# EAGLE design DES1 v70 (EAGLE 9.7.0)
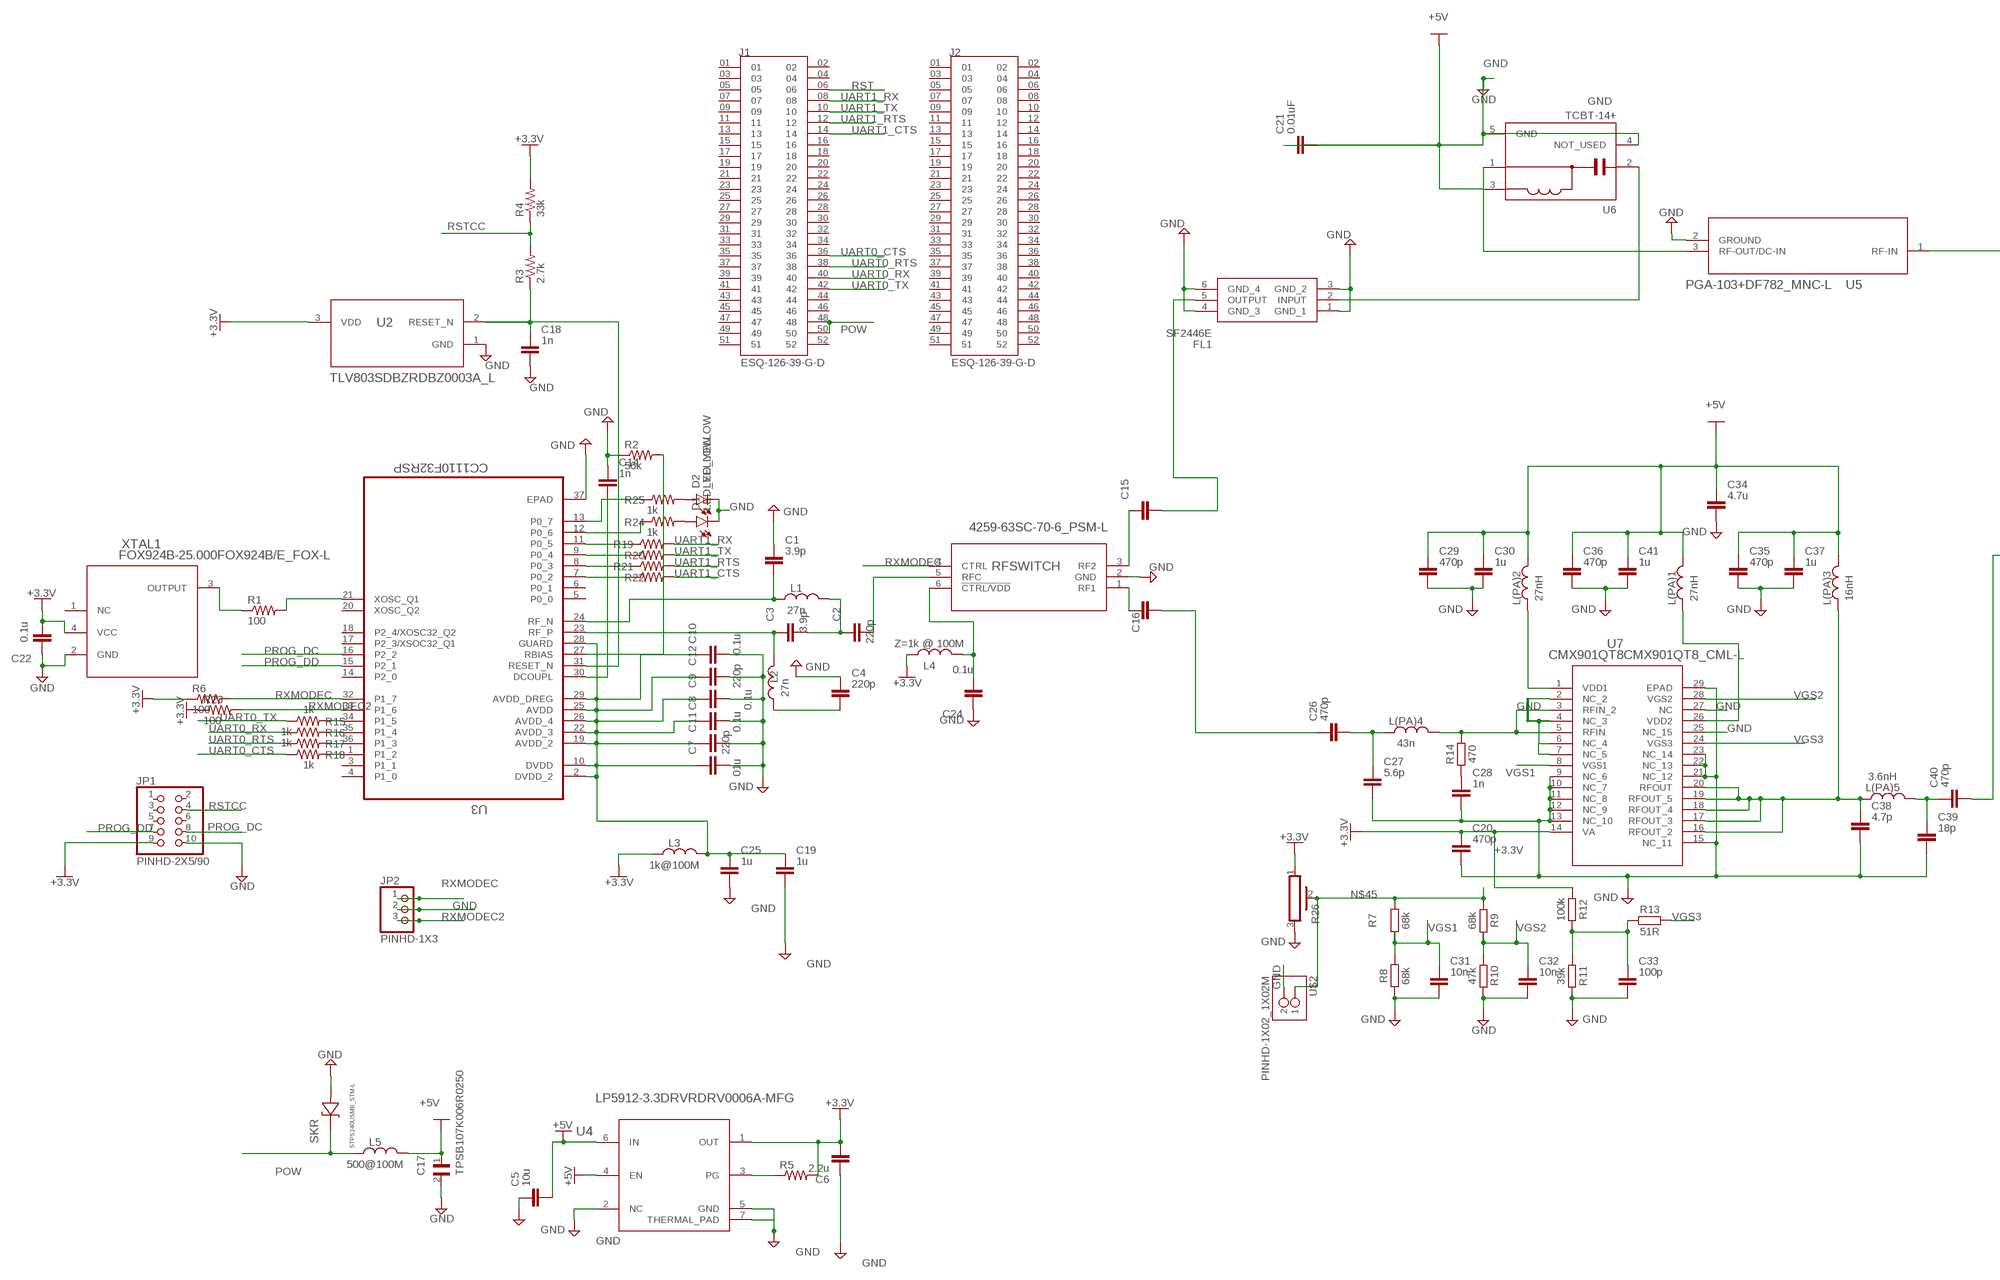
[diagram p0: schematic, sheet 1, part 1 of 2]
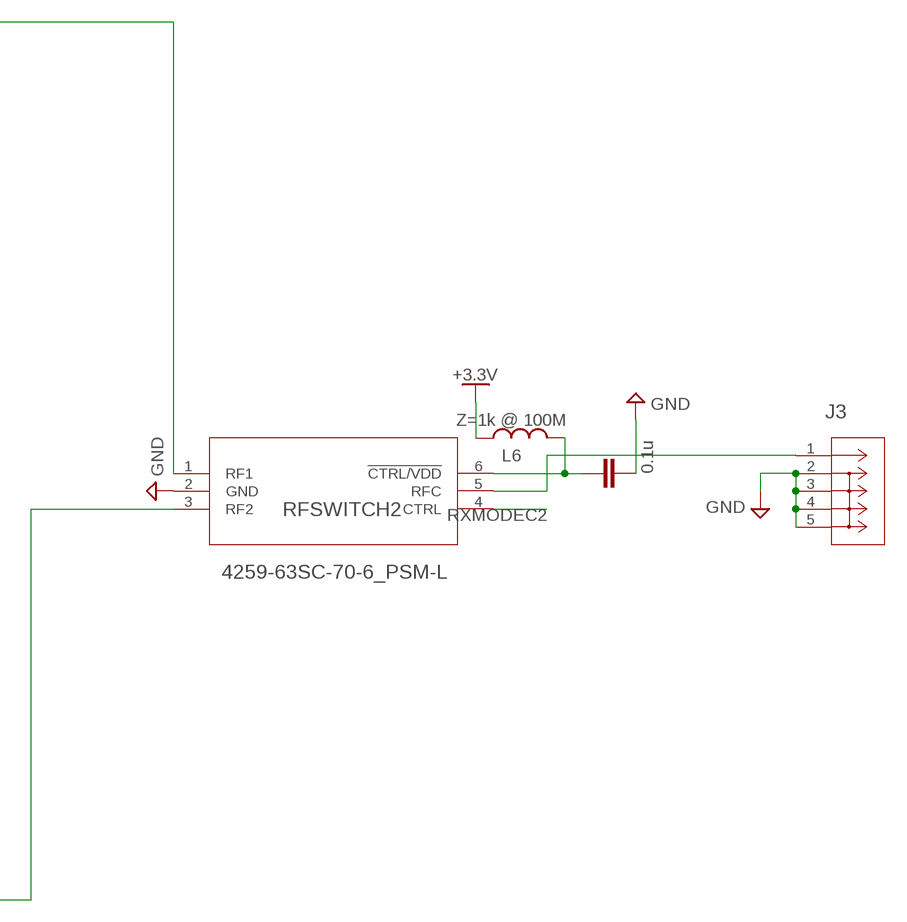
[diagram p1: schematic, sheet 1, part 2 of 2]

## Parts
C1  3.9p  C_CHIP-0402(1005-METRIC)  [CAPC1005X60]
C2  220p  C_CHIP-0402(1005-METRIC)  [CAPC1005X60]
C3  3.9p  C_CHIP-0402(1005-METRIC)  [CAPC1005X60]
C4  220p  C_CHIP-0402(1005-METRIC)  [CAPC1005X60]
C5  10u  C_CHIP-0603(1608-METRIC)  [CAPC1608X85]
C6  2.2u  C_CHIP-0603(1608-METRIC)  [CAPC1608X85]
C7  01u  C_CHIP-0603(1608-METRIC)  [CAPC1608X85]
C8  0.1u  C_CHIP-0603(1608-METRIC)  [CAPC1608X85]
C9  0.1u  C_CHIP-0603(1608-METRIC)  [CAPC1608X85]
C10  0.1u  C_CHIP-0603(1608-METRIC)  [CAPC1608X85]
C11  220p  C_CHIP-0402(1005-METRIC)  [CAPC1005X60]
C12  220p  C_CHIP-0402(1005-METRIC)  [CAPC1005X60]
C13  0.1u  C_CHIP-0603(1608-METRIC)  [CAPC1608X85]
C14  1n  C_CHIP-0603(1608-METRIC)  [CAPC1608X85]
C15  C_CHIP-0402(1005-METRIC)  [CAPC1005X60]
C16  C_CHIP-0402(1005-METRIC)  [CAPC1005X60]
C17  TPSB107K006R0250  [CAPPC3528X210N]
C18  1n  C_CHIP-0603(1608-METRIC)  [CAPC1608X85]
C19  1u  C_CHIP-0603(1608-METRIC)  [CAPC1608X85]
C20  470p  C_CHIP-0603(1608-METRIC)  [CAPC1608X85]
C21  0.01uF  C_CHIP-0805(2012-METRIC)  [CAPC2012X110]
C22  0.1u  C_CHIP-0603(1608-METRIC)  [CAPC1608X85]
C24  0.1u  C_CHIP-0603(1608-METRIC)  [CAPC1608X85]
C25  1u  C_CHIP-0603(1608-METRIC)  [CAPC1608X85]
C26  470p  C_CHIP-0603(1608-METRIC)  [CAPC1608X85]
C27  5.6p  C_CHIP-0603(1608-METRIC)  [CAPC1608X85]
C28  1n  C_CHIP-0603(1608-METRIC)  [CAPC1608X85]
C29  470p  C_CHIP-0603(1608-METRIC)  [CAPC1608X85]
C30  1u  C_CHIP-0603(1608-METRIC)  [CAPC1608X85]
C31  10n  C_CHIP-0603(1608-METRIC)  [CAPC1608X85]
C32  10n  C_CHIP-0603(1608-METRIC)  [CAPC1608X85]
C33  100p  C_CHIP-0603(1608-METRIC)  [CAPC1608X85]
C34  4.7u  C_CHIP-0603(1608-METRIC)  [CAPC1608X85]
C35  470p  C_CHIP-0603(1608-METRIC)  [CAPC1608X85]
C36  470p  C_CHIP-0603(1608-METRIC)  [CAPC1608X85]
C37  1u  C_CHIP-0603(1608-METRIC)  [CAPC1608X85]
C38  4.7p  C_CHIP-0603(1608-METRIC)  [CAPC1608X85]
C39  18p  C_CHIP-0603(1608-METRIC)  [CAPC1608X85]
C40  470p  C_CHIP-0603(1608-METRIC)  [CAPC1608X85]
C41  1u  C_CHIP-0603(1608-METRIC)  [CAPC1608X85]
D1  LED_YELLOW  CHIP-FLAT-Y_0402  [LEDC1005X25N_FLAT-Y]
D2  LED_YELLOW  CHIP-FLAT-Y_0402  [LEDC1005X25N_FLAT-Y]
FL1  SF2446E  [SF2446E]
J1  ESQ-126-39-G-D  [SAMTEC_ESQ-126-39-G-D]
J2  ESQ-126-39-G-D  [SAMTEC_ESQ-126-39-G-D]
J3  733910070CONN_73391-0070_MOL  [CONN_73391-0070_MOL]
JP1  PINHD-2X5/90  [2X05/90]
JP2  PINHD-1X3  [1X03]
L1  27n  INDUCTOR_CHIP-0402(1006-METRIC)  [INDC1006X60N]
L2  27n  INDUCTOR_CHIP-0402(1006-METRIC)  [INDC1006X60N]
L3  1k@100M  INDUCTOR_CHIP-0603(1608-METRIC)  [INDC1608X95N]
L4  Z=1k @ 100M  INDUCTOR_CHIP-0603(1608-METRIC)  [INDC1608X95N]
L5  500@100M  INDUCTOR_CHIP-1206(3216-METRIC)  [INDC3216X190]
L6  Z=1k @ 100M  INDUCTOR_CHIP-0603(1608-METRIC)  [INDC1608X95N]
L(PA)1  27nH  L_CHIP-0603(1608-METRIC)  [INDC1608X95N]
L(PA)2  27nH  L_CHIP-0603(1608-METRIC)  [INDC1608X95N]
L(PA)3  16nH  L_CHIP-0603(1608-METRIC)  [INDC1608X95N]
L(PA)4  43n  L_CHIP-0603(1608-METRIC)  [INDC1608X95N]
L(PA)5  3.6nH  INDUCTOR_CHIP-0603(1608-METRIC)  [INDC1608X95N]
R1  100  R-US_CHIP-0603(1608-METRIC)  [RESC1608X60]
R2  56k  R-US_CHIP-0603(1608-METRIC)  [RESC1608X60]
R3  2.7k  R-US_CHIP-0603(1608-METRIC)  [RESC1608X60]
R4  33k  R-US_CHIP-0603(1608-METRIC)  [RESC1608X60]
R5  R-US_CHIP-0603(1608-METRIC)  [RESC1608X60]
R6  100  R-US_CHIP-0603(1608-METRIC)  [RESC1608X60]
R7  68k  R_CHIP-0603(1608-METRIC)  [RESC1608X60]
R8  68k  R_CHIP-0603(1608-METRIC)  [RESC1608X60]
R9  68k  R_CHIP-0603(1608-METRIC)  [RESC1608X60]
R10  47k  R_CHIP-0603(1608-METRIC)  [RESC1608X60]
R11  39k  R_CHIP-0603(1608-METRIC)  [RESC1608X60]
R12  100k  R_CHIP-0603(1608-METRIC)  [RESC1608X60]
R13  51R  R_CHIP-0603(1608-METRIC)  [RESC1608X60]
R14  470  R_CHIP-0603(1608-METRIC)  [RESC1608X60]
R15  1k  R-US_CHIP-0603(1608-METRIC)  [RESC1608X60]
R16  1k  R-US_CHIP-0603(1608-METRIC)  [RESC1608X60]
R17  1k  R-US_CHIP-0603(1608-METRIC)  [RESC1608X60]
R18  1k  R-US_CHIP-0603(1608-METRIC)  [RESC1608X60]
R19  R-US_CHIP-0603(1608-METRIC)  [RESC1608X60]
R20  R-US_CHIP-0603(1608-METRIC)  [RESC1608X60]
R21  R-US_CHIP-0603(1608-METRIC)  [RESC1608X60]
R22  R-US_CHIP-0603(1608-METRIC)  [RESC1608X60]
R23  100  R-US_CHIP-0603(1608-METRIC)  [RESC1608X60]
R24  1k  R-US_CHIP-0603(1608-METRIC)  [RESC1608X60]
R25  1k  R-US_CHIP-0603(1608-METRIC)  [RESC1608X60]
R26  POT_PV36P  [PV36P]
RFSWITCH  4259-63SC-70-6_PSM-L  [SC-70-6_PSM-L]
RFSWITCH2  4259-63SC-70-6_PSM-L  [SC-70-6_PSM-L]
SKR  STPS340USMB_STM-L  [SMB_STM-L]
U2  TLV803SDBZRDBZ0003A_L  [DBZ0003A_L]
U3  CC1110F32RSP  [QFN50P600X600X90-37N]
U4  LP5912-3.3DRVRDRV0006A-MFG  [DRV0006A-MFG]
U5  PGA-103+DF782_MNC-L  [DF782_MNC-L]
U6  TCBT-14+  [IC_TCBT-14+]
U7  CMX901QT8CMX901QT8_CML-L  [CMX901QT8_CML-L]
U$2  PINHD-1X02_1X02M  [1X02]
XTAL1  FOX924B-25.000FOX924B/E_FOX-L  [FOX924B/E_FOX-L]

## Nets
+3.3V [POWER]: C6.2 C20.1 C22.2 JP1.9 L3.1 L4.1 L6.1 R4.2 R5.2 R6.1 R12.1 R23.1 R26.1 U2.3(VDD) U4.1(OUT) U7.14(VA) XTAL1.4(VCC)
+5V [POWER]: C5.2 C17.1 C21.1 C29.1 C30.1 C34.1 C35.1 C36.1 C37.1 C41.1 L5.2 L(PA)1.2 L(PA)2.2 L(PA)3.2 U4.4(EN) U4.6(IN) U6.3(DC)
GND [GND]: C1.1 C4.1 C5.1 C6.1 C7.2 C8.2 C9.2 C10.2 C11.2 C12.2 C13.2 C14.1 C17.2 C18.2 C19.2 C20.2 C21.2 C22.1 C24.1 C25.2 C27.2 C28.2 C29.2 C30.2 C31.2 C32.2 C33.2 C34.2 C35.2 C36.2 C37.2 C38.2 C39.2 C41.2 D1.C D2.C FL1.1(GND_1) FL1.3(GND_2) FL1.4(GND_3) FL1.6(GND_4) J3.2 J3.3 J3.4 J3.5 JP1.10 JP2.2 R2.1 R8.1 R10.2 R11.2 R26.3 RFSWITCH2.2(GND) RFSWITCH.2(GND) SKR.1(K) U2.1(GND) U3.37(EPAD) U4.2(NC) U4.5(GND) U4.7(THERMAL_PAD) U5.2(GROUND) U6.4(NOT_USED) U6.5(GND) U7.2(NC_2) U7.4(NC_3) U7.6(NC_4) U7.7(NC_5) U7.9(NC_6) U7.10(NC_7) U7.11(NC_8) U7.12(NC_9) U7.13(NC_10) U7.15(NC_11) U7.21(NC_12) U7.22(NC_13) U7.23(NC_14) U7.25(NC_15) U7.27(NC) U7.29(EPAD) U$2.2 XTAL1.2(GND)
N$1 [RF]: C15.1 RFSWITCH.3(RF2)
N$2 [RF]: C3.1 L2.2 U3.23(RF_P)
N$3 [RF]: C2.1 C3.2 L1.2
N$4 [RF]: C2.2 RFSWITCH.5(RFC)
N$5 [RF]: C4.2 L2.1
N$6 [RF]: C1.2 L1.1 U3.24(RF_N)
N$7: R22.1 U3.7(P0_2)
N$8: D1.A R24.2
N$9: R21.1 U3.8(P0_3)
N$10: R20.1 U3.9(P0_4)
N$11: R19.1 U3.11(P0_5)
N$12: R15.2 U3.34(P1_5)
N$13: R16.2 U3.35(P1_4)
N$14: R17.2 U3.36(P1_3)
N$15: R18.2 U3.1(P1_2)
N$16: R1.2 U3.21(XOSC_Q1)
N$17: R1.1 XTAL1.3(OUTPUT)
N$18: C24.2 L4.2 RFSWITCH.6(!CTRL/VDD)
N$19 [RF]: C16.2 C26.1
N$20 [RF]: RFSWITCH2.1(RF1) U5.1(RF-IN)
N$21 [RF]: C15.2 FL1.5(OUTPUT)
N$22 [RF]: U5.3(RF-OUT/DC-IN) U6.1(RF_DC)
N$23: C14.2 U3.30(DCOUPL)
N$27: D2.A R25.2
N$28 [RF]: C16.1 RFSWITCH.1(RF1)
N$30: FL1.2(INPUT) U6.2(RF)
N$31: R5.1 U4.3(PG)
N$32: R24.1 U3.12(P0_6)
N$33 [RF]: J3.1 RFSWITCH2.5(RFC)
N$34 [RF]: C39.1 C40.1 L(PA)5.2
N$35 [RF]: L(PA)4.2 R14.2 U7.3(RFIN_2) U7.5(RFIN)
N$37 [RF]: C26.2 C27.1 L(PA)4.1
N$38: L(PA)2.1 U7.1(VDD1)
N$39: L(PA)1.1 U7.26(VDD2)
N$40 [RF]: C38.1 L(PA)3.1 L(PA)5.1 U7.16(RFOUT_2) U7.17(RFOUT_3) U7.18(RFOUT_4) U7.19(RFOUT_5) U7.20(RFOUT)
N$41: C33.1 R11.1 R12.2 R13.1
N$42: C13.1 L6.2 RFSWITCH2.6(!CTRL/VDD)
N$43: C28.1 R14.1
N$44: R25.1 U3.13(P0_7)
N$45 [POWER]: R7.2 R9.1 R26.2 U$2.1
N$55 [RF]: C40.2 RFSWITCH2.3(RF2)
N$57: C7.1 C8.1 C9.1 C10.1 C11.1 C12.1 C19.1 C25.1 L3.2 U3.2(DVDD_2) U3.10(DVDD) U3.19(AVDD_2) U3.22(AVDD_3) U3.25(AVDD) U3.26(AVDD_4) U3.28(GUARD) U3.29(AVDD_DREG)
N$62: R2.2 U3.27(RBIAS)
POW: J1.48 J1.50 L5.1 SKR.2(A)
PROG_DC: JP1.8 U3.16(P2_2)
PROG_DD: JP1.7 U3.15(P2_1)
RST: C18.1 J1.06 R3.1 U2.2(RESET_N) U3.31(RESET_N)
RSTCC: JP1.4 R3.2 R4.1
RXMODEC: JP2.1 R6.2 RFSWITCH.4(CTRL) U3.32(P1_7)
RXMODEC2: JP2.3 R23.2 RFSWITCH2.4(CTRL) U3.33(P1_6)
UART0_CTS [UART]: J1.36 R18.1
UART0_RTS [UART]: J1.38 R17.1
UART0_RX [UART]: J1.40 R16.1
UART0_TX [UART]: J1.42 R15.1
UART1_CTS [UART]: J1.14 R22.2
UART1_RTS [UART]: J1.12 R21.2
UART1_RX [UART]: J1.08 R19.2
UART1_TX [UART]: J1.10 R20.2
VGS1: C31.1 R7.1 R8.2 U7.8(VGS1)
VGS2: C32.1 R9.2 R10.1 U7.28(VGS2)
VGS3: R13.2 U7.24(VGS3)
Unconnected: J1.01 J1.02 J1.03 J1.04 J1.05 J1.07 J1.09 J1.11 J1.13 J1.15 J1.16 J1.17 J1.18 J1.19 J1.20 J1.21 J1.22 J1.23 J1.24 J1.25 J1.26 J1.27 J1.28 J1.29 J1.30 J1.31 J1.32 J1.33 J1.34 J1.35 J1.37 J1.39 J1.41 J1.43 J1.44 J1.45 J1.46 J1.47 J1.49 J1.51 J1.52 J2.01 J2.02 J2.03 J2.04 J2.05 J2.06 J2.07 J2.08 J2.09 J2.10 J2.11 J2.12 J2.13 J2.14 J2.15 J2.16 J2.17 J2.18 J2.19 J2.20 J2.21 J2.22 J2.23 J2.24 J2.25 J2.26 J2.27 J2.28 J2.29 J2.30 J2.31 J2.32 J2.33 J2.34 J2.35 J2.36 J2.37 J2.38 J2.39 J2.40 J2.41 J2.42 J2.43 J2.44 J2.45 J2.46 J2.47 J2.48 J2.49 J2.50 J2.51 J2.52 JP1.1 JP1.2 JP1.3 JP1.5 JP1.6 U3.3(P1_1) U3.4(P1_0) U3.5(P0_0) U3.6(P0_1) U3.14(P2_0) U3.17(P2_3/XSOC32_Q1) U3.18(P2_4/XOSC32_Q2) U3.20(XOSC_Q2) XTAL1.1(NC)

## Library data of the parts
C1-C6 C11 C12 C19 C25 = Tutorial - Fusion 360:C: Capacitor - Generic; CATEGORY: Capacitor
C7-C10 C13-C16 C18 C20-C22 C24 C26-C41 = Capacitor:C: Capacitor - Generic; CATEGORY: Capacitor
C17 = TPSB107K006R0250:TPSB107K006R0250: Cap Tant Solid 100uF 6.3V B CASE 10% (3.5 X 2.8 X 1.9mm) SMD 3528-21 0.25 Ohm 125AHA T/R
D1 D2 = LED:CHIP-FLAT-Y; CATEGORY: LED; COLOR: YELLOW; DESCRIPTION: CHIP LED FLAT; SUB-CATEGORY: CHIP; TYPE: FLAT_TOP
FL1 = SF2446E:SF2446E: 435MHz Frequency General Purpose RF SAW Filter (Surface Acoustic Wave) 1.9dB 23MHz Bandwidth 6-SMD, No Lead Source: Datasheet <https://www.rfmi.co/pdf/Datasheet/sf2446e.pdf>; DESCRIPTION: 435MHz Frequency General Purpose RF SAW Filter (Surface Acoustic Wave) 1.9dB 23MHz Bandwidth 6-SMD, No Lead; HEIGHT: 1.38mm; MANUFACTURER_NAME: RFMi; MANUFACTURER_PART_NUMBER: SF2446E; MOUSER_PART_NUMBER: 198-SF2446E; MOUSER_PRICE-STOCK: https://www.mouser.co.uk/ProductDetail/RFMi/SF2446E?qs=zW32dvEIR3sXFG4t1NXQKw%3D%3D
J1 J2 = ESQ-126-39-G-D:ESQ-126-39-G-D; MANUFACTURER: Samtec; PARTREV: R; STANDARD: Manufacturer Recommendations
J3 = 2024-07-09_09-21-08_Library:733910070; COPYRIGHT: Copyright (C) 2024 Ultra Librarian. All rights reserved.; MANUFACTURER_PART_NUMBER: 733910070; MFR_NAME: Molex Connector Corporation
JP1 = Connector:PINHD-2X5: PIN HEADER; CATEGORY: Headers; DESCRIPTION: Header, Right Angle, 2x5 Position; MANUFACTURER: Generic; MPN: Generic; OPERATING_TEMPERATURE: Generic; PART_STATUS: Active; PITCH: 0.100" (2.54mm); ROHS_COMPLIANCE: Generic; SERIES: Generic; SUB-CATEGORY: Headers, Male Pins; TYPE: Board to Board or Cable, Unshrouded, Through Hole, Right Angle
JP2 = Connector:PINHD-1X3: PIN HEADER; CATEGORY: Headers; DESCRIPTION: Header, Straight, 3 Position; MANUFACTURER: Generic; MPN: Generic; OPERATING_TEMPERATURE: Generic; PART_STATUS: Active; PITCH: 0.100" (2.54mm); ROHS_COMPLIANCE: Generic; SERIES: Generic; SUB-CATEGORY: Headers, Male Pins; TYPE: Board to Board or Cable, Unshrouded, Through Hole, Straight
L1-L6 L(PA)5 = Tinkercad:INDUCTOR: Inductor Fixed - Generic; CATEGORY: Inductor; SUB-CATEGORY: Fixed
L(PA)1-L(PA)4 = Inductor:L: Inductor Fixed - Generic; CATEGORY: Inductor; SUB-CATEGORY: Fixed
R1-R6 R15-R25 = Tutorial - Fusion 360:R-US: Resistor Fixed - ANSI; CATEGORY: Resistor; SUB-CATEGORY: Fixed
R7-R14 = Resistor:R: Resistor Fixed - Generic; CATEGORY: Resistor; SUB-CATEGORY: Fixed
R26 = Tinkercad:POT: Rectangular Trimmer Potentiometers - PV36 Series Datasheet <https://www.bourns.com/docs/Product-Datasheets/pv36.pdf>; CATEGORY: Resistor; DESCRIPTION: Lead Sealed Type Multiturn PV36 Series; MANUFACTURER: BOURNS; MPN: PV36P; OPERATING_TEMPERATURE: -55 to +125 °C; PART_STATUS: Active; ROHS_COMPLIANCE: RoHS Compliant; SERIES: PV36; SUB-CATEGORY: Trimpot; TYPE: Lead Sealed
RFSWITCH RFSWITCH2 = 2024-06-27_05-52-14_Library:4259-63; COPYRIGHT: Copyright (C) 2024 Ultra Librarian. All rights reserved.; MANUFACTURER_PART_NUMBER: 4259-63; MFR_NAME: pSemi
SKR = 2024-06-27_10-15-36_Library:STPS340U; COPYRIGHT: Copyright (C) 2024 Ultra Librarian. All rights reserved.; MANUFACTURER_PART_NUMBER: STPS340U; MFR_NAME: STMicroelectronics
U2 = 2024-06-28_11-20-22_Library:TLV803SDBZR; COPYRIGHT: Copyright (C) 2024 Ultra Librarian. All rights reserved.; MANUFACTURER_PART_NUMBER: TLV803SDBZR; MFR_NAME: Texas Instruments; REFDES: RefDes; TYPE: TYPE
U3 = CC1110F32RSP:CC1110F32RSP: RF Transceiver, and USB Controller Check availability <https://pricing.snapeda.com/parts/CC1110F32RSP/Texas%20Instruments/view-part?ref=eda>; AVAILABILITY: In Stock; CHECK_PRICES: https://www.snapeda.com/parts/CC1110F32RSP/Texas+Instruments/view-part/?ref=eda; DESCRIPTION: IC RF TxRx + MCU General ISM < 1GHz - 300MHz ~ 348MHz, 391MHz ~ 464MHz, 782MHz ~ 928MHz 36-VFQFN Exposed Pad; MF: Texas Instruments; MP: CC1110F32RSP; PACKAGE: VQFN-36 Texas Instruments; PRICE: None; SNAPEDA_LINK: https://www.snapeda.com/parts/CC1110F32RSP/Texas+Instruments/view-part/?ref=snap
U4 = 2024-06-28_11-39-00_Library:LP5912-3.3DRVR; COPYRIGHT: Copyright (C) 2024 Ultra Librarian. All rights reserved.; MANUFACTURER_PART_NUMBER: LP5912-3.3DRVR; MFR_NAME: Texas Instruments; REFDES: RefDes; TYPE: TYPE
U5 = 2024-06-22_09-05-09_Library:PGA-103+; COPYRIGHT: Copyright (C) 2024 Ultra Librarian. All rights reserved.; MANUFACTURER_PART_NUMBER: PGA-103+; MFR_NAME: Mini Circuits
U6 = TCBT-14_:TCBT-14+: Check availability <https://pricing.snapeda.com/parts/TCBT-14%2B/Mini-Circuits/view-part?ref=eda>; AVAILABILITY: In Stock; CHECK_PRICES: https://www.snapeda.com/parts/TCBT-14+/Mini-Circuits/view-part/?ref=eda; DESCRIPTION: RF IC Bias Tee General Purpose 10MHz ~ 10GHz - GU1414; MF: Mini-Circuits; MP: TCBT-14+; PACKAGE: Package; PRICE: None; PURCHASE-URL: https://www.snapeda.com/api/url_track_click_mouser/?unipart_id=3625442&manufacturer=Mini-Circuits&part_name=TCBT-14+&search_term=tcbt-14+; SNAPEDA_LINK: https://www.snapeda.com/parts/TCBT-14+/Mini-Circuits/view-part/?ref=snap
U7 = 2024-06-27_11-15-28_Library:CMX901QT8; COPYRIGHT: Copyright (C) 2024 Ultra Librarian. All rights reserved.; MANUFACTURER_PART_NUMBER: CMX901QT8; MFR_NAME: CML
U$2 = Tinkercad:PINHD-1X02
XTAL1 = 2024-06-26_11-30-46_Library:FOX924B-25.000; COPYRIGHT: Copyright (C) 2024 Ultra Librarian. All rights reserved.; MANUFACTURER_PART_NUMBER: FOX924B-25.000; MFR_NAME: Fox

## Net classes
4 RF: width 0.201 mm

## Board
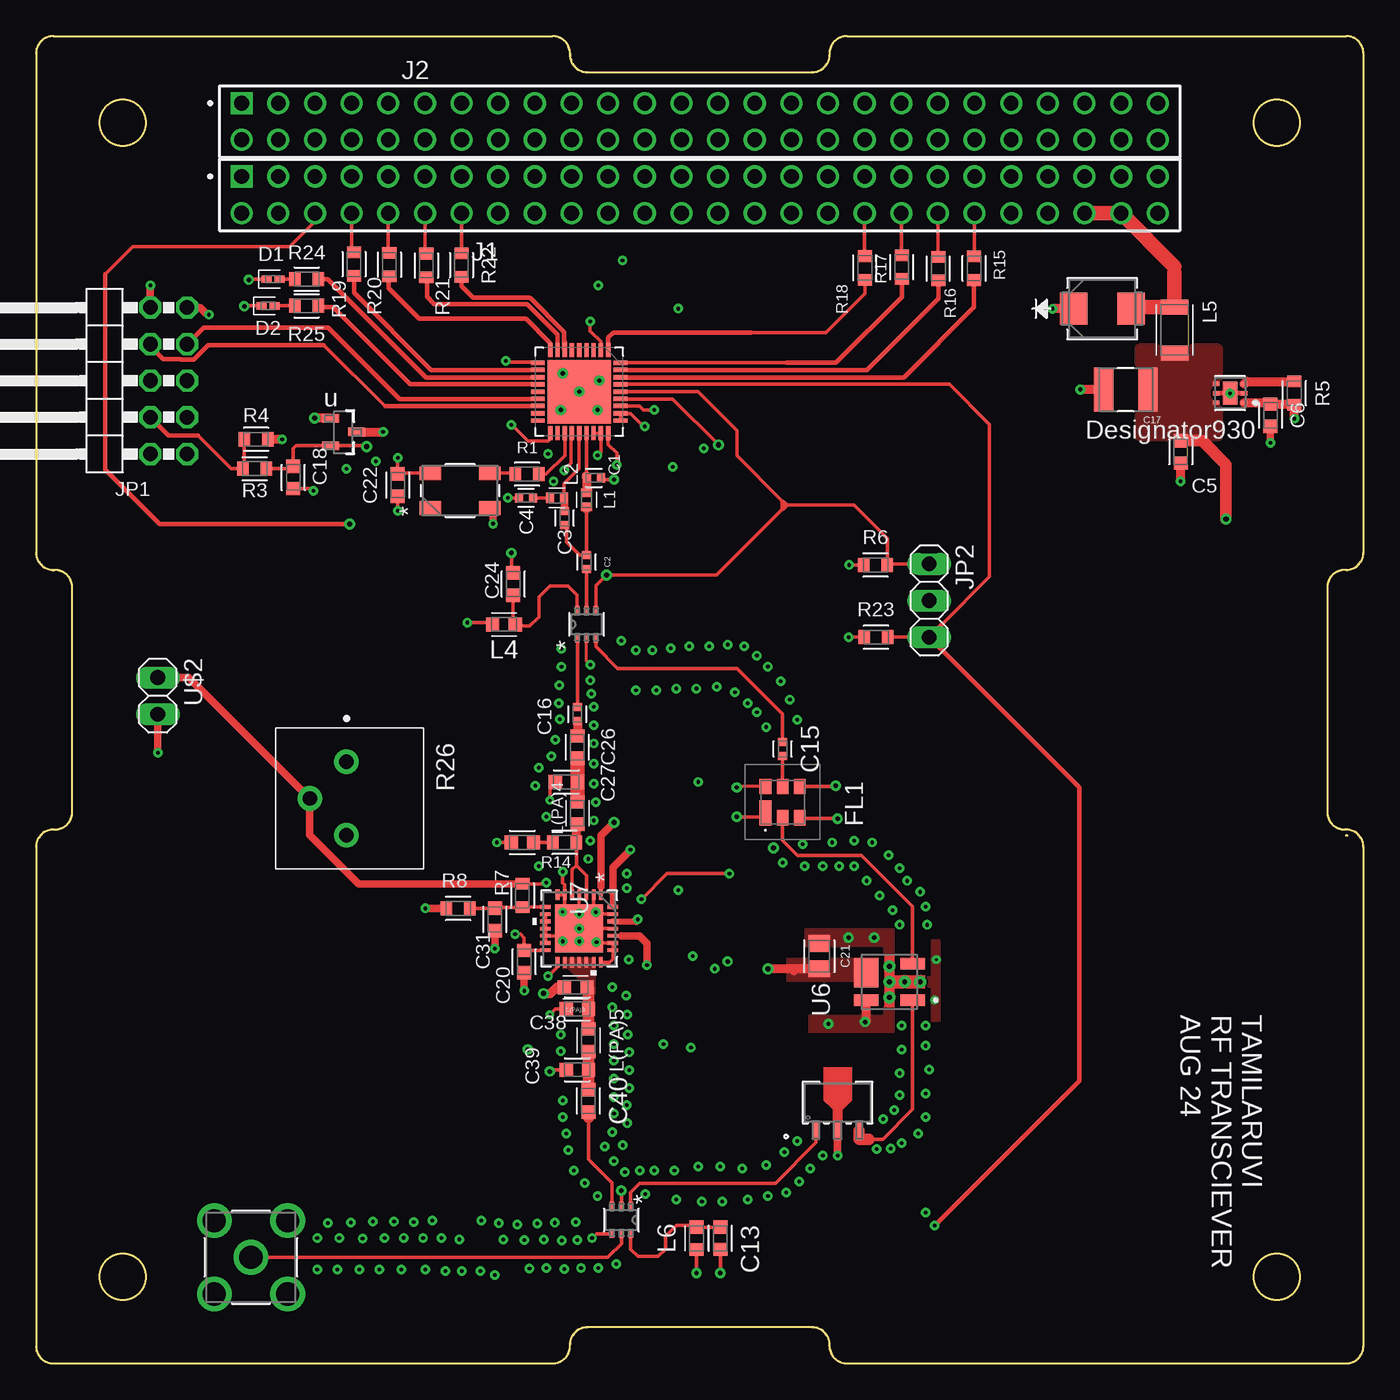
[diagram p2: board, top side]
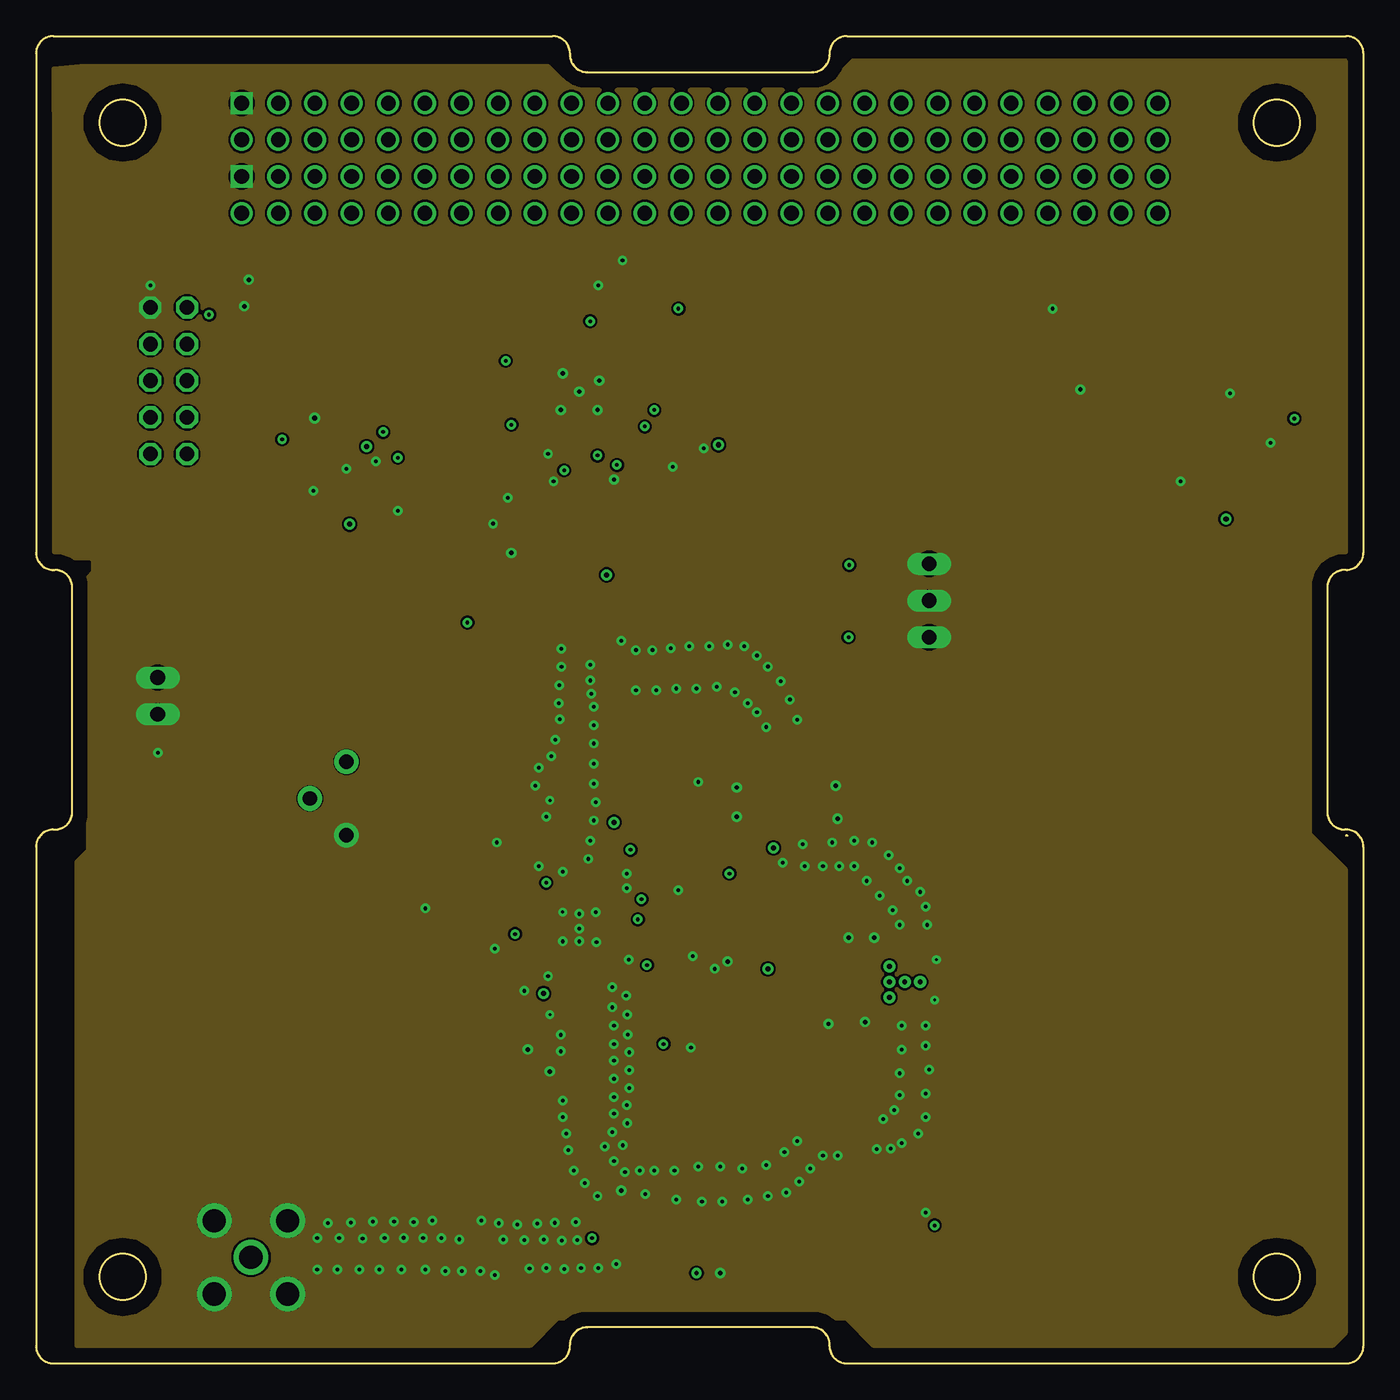
[diagram p3: board, inner layer Route2]
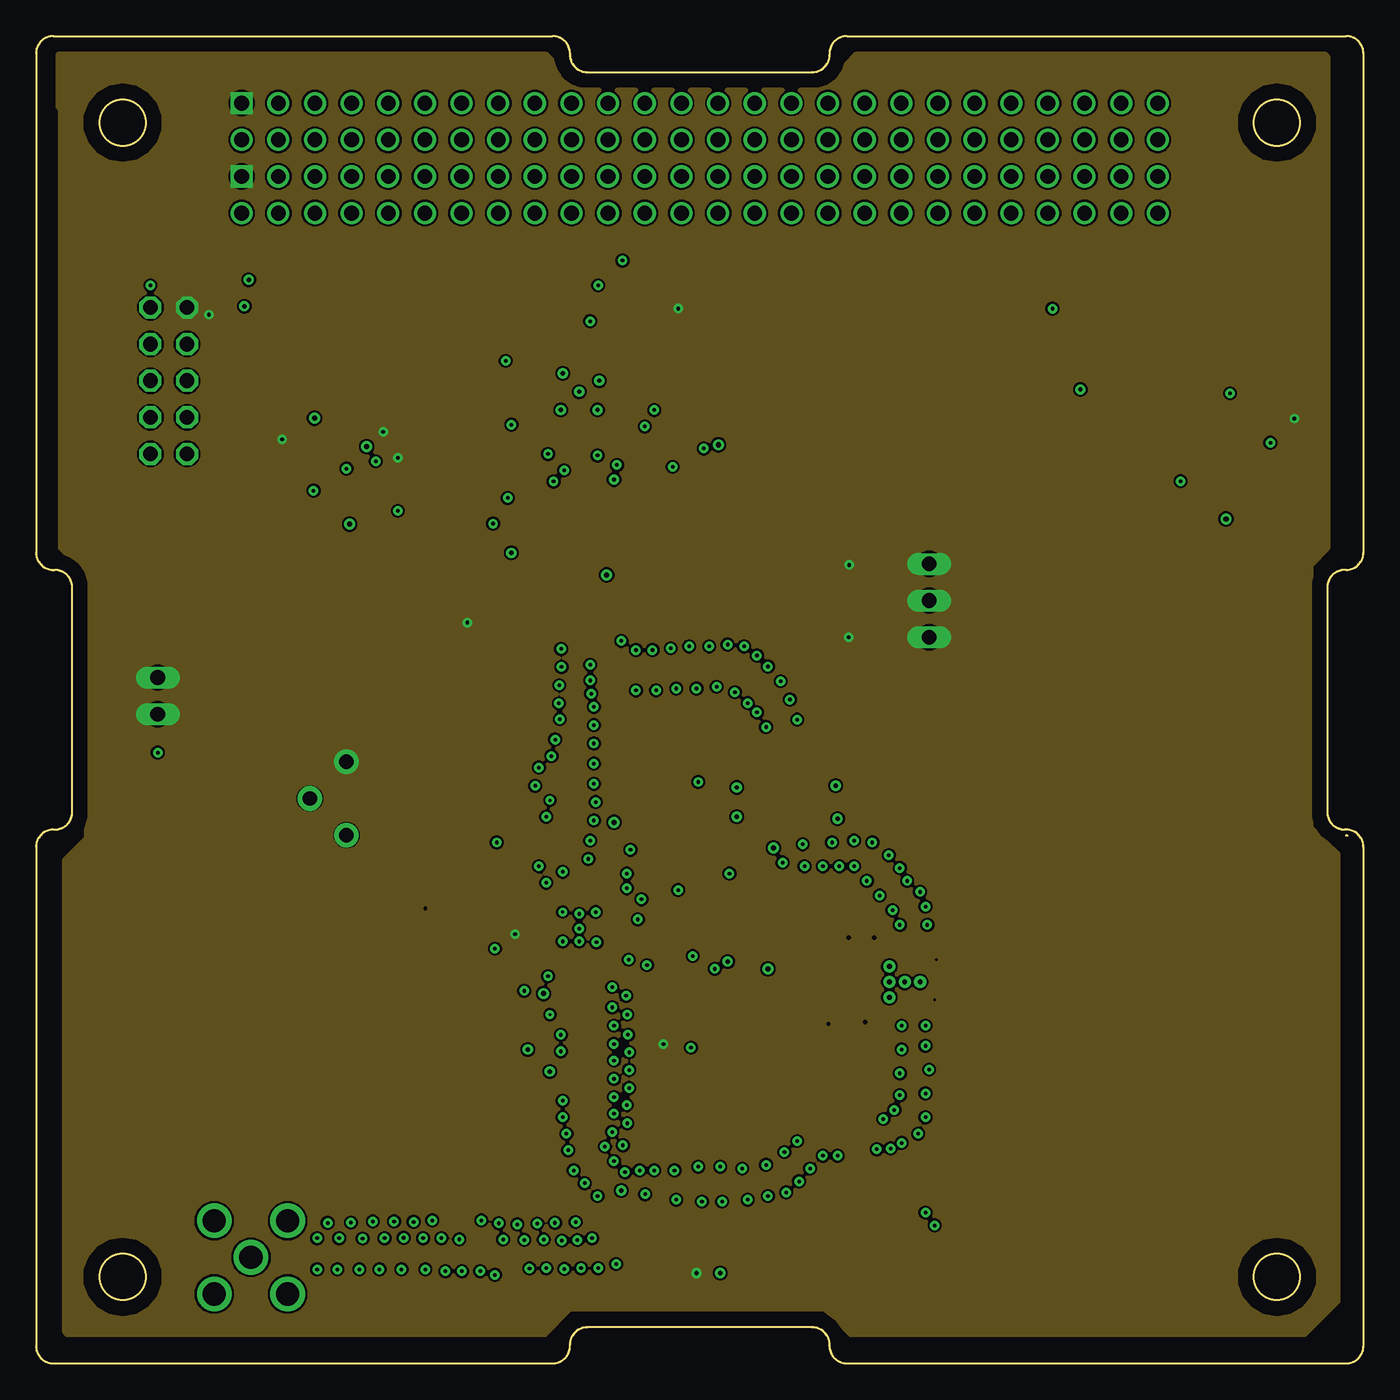
[diagram p4: board, inner layer Route15]
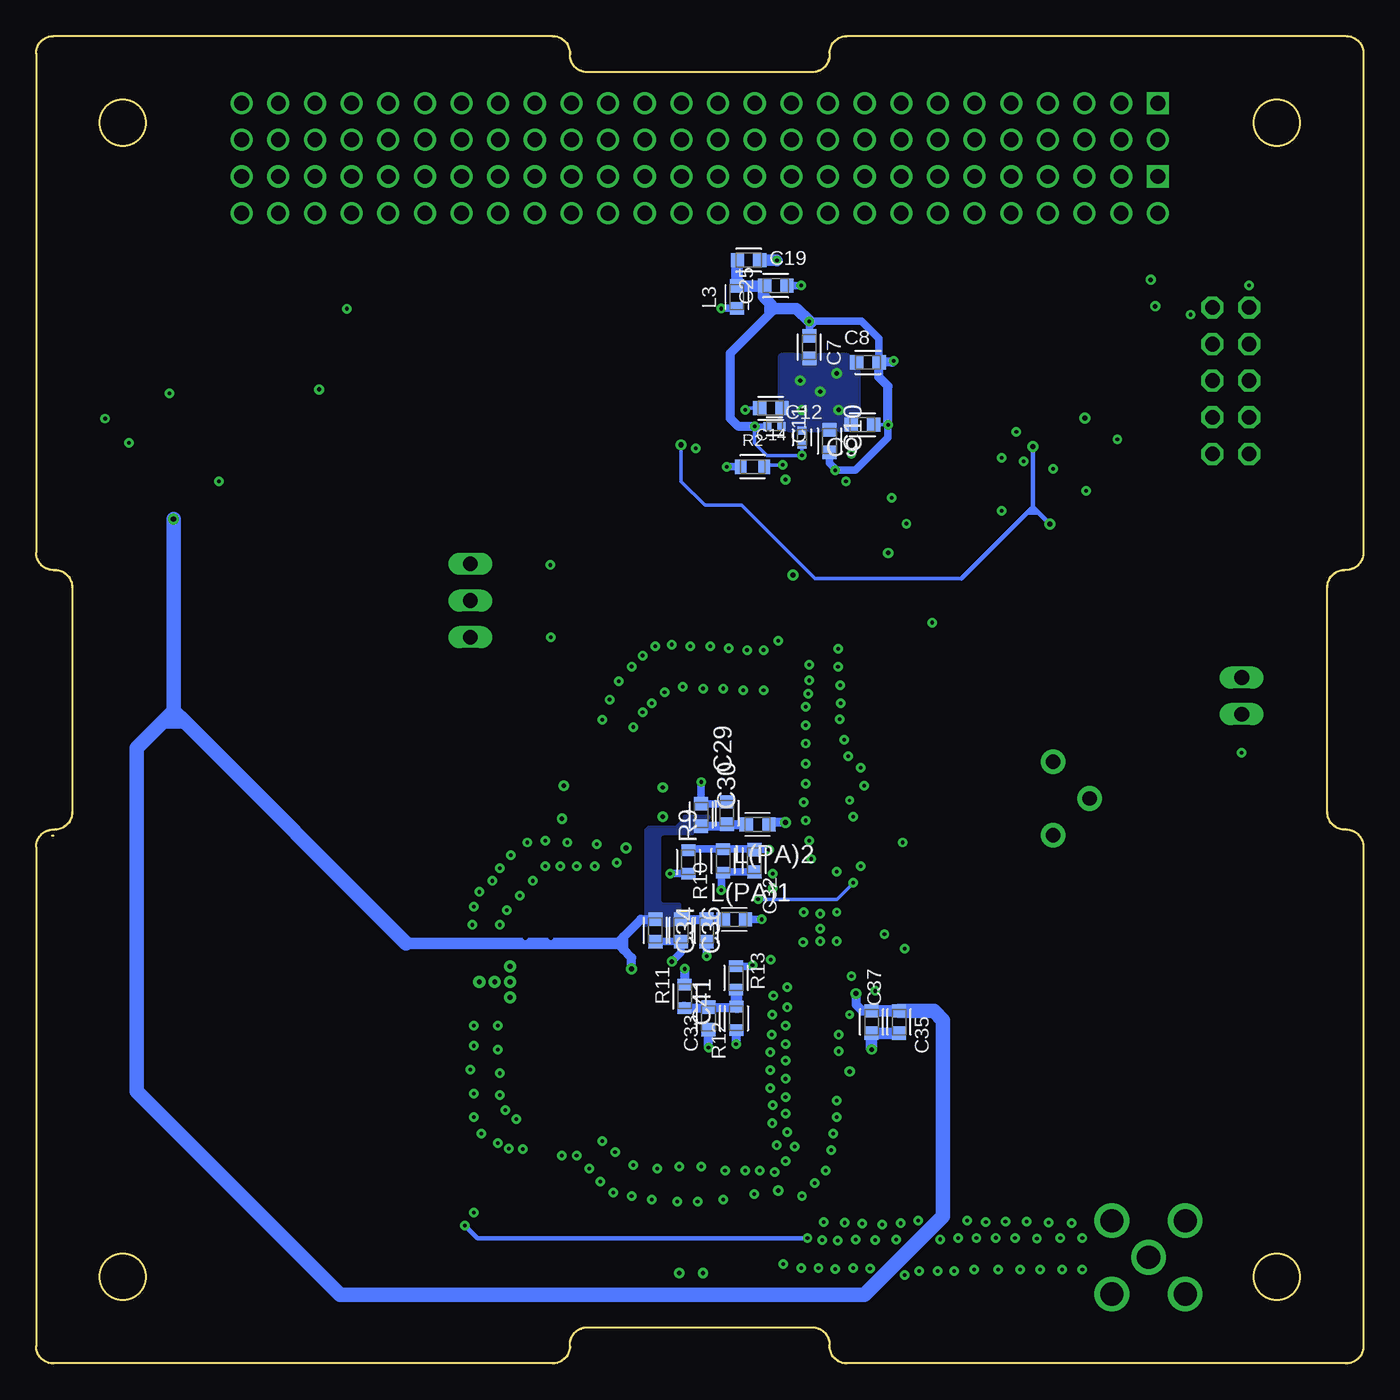
[diagram p5: board, bottom side, seen from below]

Size 92 x 92 mm. Coordinates in mm from the lower left corner, seen from the top.
Outline: 37.08,90.39 37.08,90.29
Outline: 90.88,36.59 90.78,36.59
Outline: 0,1.2 arc90 1.2,0 35.8,0 arc90 37,1.2 37,1.3 arc-90 38.2,2.5 53.8,2.5 arc-90 55,1.3 55,1.2 arc90 56.2,0 90.8,0 arc90 92,1.2 92,35.8 arc90 90.8,37 90.7,37 arc-90 89.5,38.2 89.5,53.8 arc-90 90.7,55 90.8,55 arc90 92,56.2 92,90.8 arc90 90.8,92 56.2,92 arc90 55,90.8 55,90.7 arc-90 53.8,89.5 38.2,89.5 arc-90 37,90.7 37,90.8 arc90 35.8,92 1.2,92 arc90 0,90.8 0,56.2 arc90 1.2,55 1.3,55 arc-90 2.5,53.8 2.5,38.2 arc-90 1.3,37 1.2,37 arc90 0,35.8 0,1.2
Outline: circle at 6,6 radius 1.59
Outline: circle at 6,86 radius 1.59
Outline: circle at 86,6 radius 1.59
Outline: circle at 86,86 radius 1.59
Copper layers (1+2*15+16): Top / Route2 / Route15 / Bottom
Stack-up 4 Layer Stack: Top SilkScreen Epoxy Ink / Top SolderMask SR:Green 0.0254mm Dk 4.3 / Top Surface Finish Lead-Free 0.02mm / Top CuFoil:007 0.035mm / Dielectric-1 Prepreg:035 0.075mm / Dielectric-2 Prepreg:035 0.075mm / Route2 CuFoil:007 0.035mm / Dielectric-3 Core:066 0.711mm / Route15 CuFoil:007 0.035mm / Dielectric-4 Prepreg:035 0.075mm / Dielectric-5 Prepreg:035 0.075mm / Bottom CuFoil:007 0.035mm / Bottom Surface Finish Lead-Free 0.02mm / Bottom SolderMask SR:Green 0.0254mm Dk 4.3 / Bottom SilkScreen Epoxy Ink
Design rules: minimum copper width class=4 0.200659375mm, minimum copper width 6mil, minimum drill size 0.2mm, copper clearance wire_polygon to wire_polygon 6mil, copper clearance wire_polygon to pad_smd 6mil, copper clearance wire_polygon to via 6mil, copper clearance pad_smd to pad_smd 6mil, copper clearance smd to pad (same net) 6mil, copper clearance smd to via (same net) 6mil, copper clearance smd to smd (same net) 6mil, copper clearance pad_smd to via 2mil, copper clearance via to via 2mil, dimension clearance 40mil, via restrict clearance 0mil, restrict clearance 0mil, drill distance 6mil, keepout clearance 0mil
Holes 3.18 mm at 86,86 6,86 6,6 86,6

### Footprints (pad centres in the part's own frame; a part is rotated, then mirrored left to right if it is on the bottom)
CAPC1005X60 = smd 0.56 x 0.629: 1 -0.485,0; 2 0.485,0
CAPC1608X85 = smd 0.921 x 0.97: 1 -0.775,0; 2 0.775,0
CAPPC3528X210N = smd 1.34 x 3.02: 1 -1.54,0; 2 1.54,0
CAPC2012X110 = smd 1.165 x 1.465: 1 -0.875,0; 2 0.875,0
LEDC1005X25N_FLAT-Y = smd 0.7 x 0.5: A 0.45,0; C -0.45,0
SF2446E = smd 1.7 x 0.81: 1 -0.75,1.19 | smd 1.05 x 0.81: 2 -1.075,0; 3 -1.075,-1.19; 4 1.075,-1.19; 5 1.075,0; 6 1.075,1.19
SAMTEC_ESQ-126-39-G-D = drill 1.02 pad 1.37 square: 01 0,0 | drill 1.02 pad 1.37: 02 0,2.54; 03 -2.54,0; 04 -2.54,2.54; 05 -5.08,0; 06 -5.08,2.54; 07 -7.62,0; 08 -7.62,2.54; 09 -10.16,0; 10 -10.16,2.54; 11 -12.7,0; 12 -12.7,2.54; 13 -15.24,0; 14 -15.24,2.54; 15 -17.78,0; 16 -17.78,2.54; 17 -20.32,0; 18 -20.32,2.54; 19 -22.86,0; 20 -22.86,2.54; 21 -25.4,0; 22 -25.4,2.54; 23 -27.94,0; 24 -27.94,2.54; 25 -30.48,0; 26 -30.48,2.54; 27 -33.02,0; 28 -33.02,2.54; 29 -35.56,0; 30 -35.56,2.54; 31 -38.1,0; 32 -38.1,2.54; 33 -40.64,0; 34 -40.64,2.54; 35 -43.18,0; 36 -43.18,2.54; 37 -45.72,0; 38 -45.72,2.54; 39 -48.26,0; 40 -48.26,2.54; 41 -50.8,0; 42 -50.8,2.54; 43 -53.34,0; 44 -53.34,2.54; 45 -55.88,0; 46 -55.88,2.54; 47 -58.42,0; 48 -58.42,2.54; 49 -60.96,0; 50 -60.96,2.54; 51 -63.5,0; 52 -63.5,2.54
CONN_73391-0070_MOL = drill 1.6 pad 2.108: 1 0,0; 2 -2.54,2.54; 3 -2.54,-2.54; 4 2.54,-2.54; 5 2.54,2.54
2X05/90 = drill 1.016 octagon: 1 -5.08,-6.35; 2 -5.08,-3.81; 3 -2.54,-6.35; 4 -2.54,-3.81; 5 0,-6.35; 6 0,-3.81; 7 2.54,-6.35; 8 2.54,-3.81; 9 5.08,-6.35; 10 5.08,-3.81
1X03 = drill 1.016 long: 1 -2.54,0; 2 0,0; 3 2.54,0
INDC1006X60N = smd 0.56 x 0.729: 1 -0.485,0; 2 0.485,0
INDC1608X95N = smd 0.9 x 0.97: 1 -0.785,0 | smd 0.933 x 0.97: 2 0.769,0
INDC3216X190 = smd 1.043 x 1.91: 1 -1.584,0; 2 1.584,0
RESC1608X60 = smd 0.799 x 0.974: 1 -0.815,0; 2 0.815,0
PV36P = drill 1 pad 1.7: 1 0,0; 2 2.54,-2.54; 3 5.08,0
SC-70-6_PSM-L = smd 0.584 x 0.305: 1 -0.965,0.65; 2 -0.965,0; 3 -0.965,-0.65; 4 0.965,-0.65; 5 0.965,0; 6 0.965,0.65
SMB_STM-L = smd 1.905 x 2.21: 1 -1.994,0; 2 1.994,0
DBZ0003A_L = smd 1.2 x 0.6: 1 -0.9,0.95; 2 -0.9,-0.95; 3 0.9,0
QFN50P600X600X90-37N = smd 0.965 x 0.305: 1 -2.87,2.007; 2 -2.87,1.499; 3 -2.87,0.991; 4 -2.87,0.508; 5 -2.87,0; 6 -2.87,-0.508; 7 -2.87,-0.991; 8 -2.87,-1.499; 9 -2.87,-2.007; 19 2.87,-2.007; 20 2.87,-1.499; 21 2.87,-0.991; 22 2.87,-0.508; 23 2.87,0; 24 2.87,0.508; 25 2.87,0.991; 26 2.87,1.499; 27 2.87,2.007 | smd 0.305 x 0.965: 10 -2.007,-2.87; 11 -1.499,-2.87; 12 -0.991,-2.87; 13 -0.508,-2.87; 14 0,-2.87; 15 0.508,-2.87; 16 0.991,-2.87; 17 1.499,-2.87; 18 2.007,-2.87; 28 2.007,2.87; 29 1.499,2.87; 30 0.991,2.87; 31 0.508,2.87; 32 0,2.87; 33 -0.508,2.87; 34 -0.991,2.87; 35 -1.499,2.87; 36 -2.007,2.87 | smd 4.394 x 4.394: 37 0,0
DRV0006A-MFG = smd 0.45 x 0.3: 1 -0.975,0.65; 2 -0.975,0; 3 -0.975,-0.65; 4 0.975,-0.65; 5 0.975,0; 6 0.975,0.65 | smd 1 x 1.6: 7 0,0
DF782_MNC-L = smd 0.432 x 1.295: 1 -1.499,-1.943; 3 1.499,-1.943 | smd 0.508 x 1.295: 2 0,-1.943
IC_TCBT-14+ = smd 1.68 x 0.79: 1 -1.61,1.27; 2 -1.61,-1.27; 4 1.61,1.27 | smd 1.68 x 2.06: 3 1.61,-0.635 | smd 0.1 x 0.1: 5 0,0 | drill 0.33 pad 0.44: 6 0,0; 7 0,1.067; 8 0,-1.067; 9 -1.067,0; 10 -2.134,0
CMX901QT8_CML-L = smd 0.737 x 0.254: 1 -2.337,1.5; 2 -2.337,1; 3 -2.337,0.5; 4 -2.337,0; 5 -2.337,-0.5; 6 -2.337,-1; 7 -2.337,-1.5; 15 2.337,-1.5; 16 2.337,-1; 17 2.337,-0.5; 18 2.337,0; 19 2.337,0.5; 20 2.337,1; 21 2.337,1.5 | smd 0.254 x 0.737: 8 -1.5,-2.337; 9 -1,-2.337; 10 -0.5,-2.337; 11 0,-2.337; 12 0.5,-2.337; 13 1,-2.337; 14 1.5,-2.337; 22 1.5,2.337; 23 1,2.337; 24 0.5,2.337; 25 0,2.337; 26 -0.5,2.337; 27 -1,2.337; 28 -1.5,2.337 | smd 3.327 x 3.327: 29 0,0
1X02 = drill 1.016 long: 1 -1.27,0; 2 1.27,0
FOX924B/E_FOX-L = smd 0.941 x 1.495: 1 -1.206,2.056; 2 -1.206,-2.056; 3 1.206,-2.056; 4 1.206,2.056

### Placement (x,y rotation side)
C1  38.66,61.38 180 top
C2  38.15,55.54 270 top
C3  36.63,58.59 270 top
C4  33.96,59.99 0 top
C5  79.33,63.18 90 top
C6  85.55,65.72 90 top
C7  38.41,70.44 270 bottom
C8  34.34,69.38 180 bottom
C9  34.72,65.07 180 bottom
C10  37.01,63.92 90 bottom
C11  40.82,64.94 0 bottom
C12  38.91,64.18 90 bottom
C13  47.42,8.68 270 top
C14  41.07,66.21 180 bottom
C15  51.74,42.59 270 top
C16  37.52,45 270 top
C17  75.52,67.49 180 top
C18  17.83,61.41 270 top
C19  42.61,76.46 0 bottom
C20  33.83,27.85 270 top
C21  54.28,28.24 90 top
C22  25.07,60.87 90 top
C24  33.07,54.02 270 top
C25  40.73,74.7 0 bottom
C26  37.52,42.71 270 top
C27  36.76,40.3 180 top
C28  33.71,36.11 180 top
C29  44.12,38.14 90 bottom
C30  45.9,38.01 90 bottom
C31  31.8,30.78 270 top
C32  42.22,34.84 270 bottom
C33  45.39,23.92 270 bottom
C34  49.07,30.01 270 bottom
C35  32.18,23.66 270 bottom
C36  47.3,30.01 270 bottom
C37  34.09,23.66 270 bottom
C38  37.52,24.57 180 top
C39  37.52,20.36 180 top
C40  38.28,18.2 270 top
C41  45.52,30.01 270 bottom
D1  16.42,75.15 0 top
D2  16.08,73.3 0 top
FL1  51.74,38.9 90 top
J1  14.25,82.27 180 top
J2  14.25,87.35 180 top
J3  14.89,7.35 270 top
JP1  4.12,68.11 90 top
JP2  61.9,52.87 270 top
L1  38.15,59.86 270 top
L2  36.12,59.99 0 top
L3  43.43,73.91 90 bottom
L4  32.44,51.22 0 top
L5  78.91,71.62 270 top
L6  45.77,8.68 90 top
L(PA)1  43.61,30.78 180 bottom
L(PA)2  42,37.36 180 bottom
L(PA)3  37.39,26.08 180 top
L(PA)4  37.52,38.14 270 top
L(PA)5  38.28,22.39 270 top
R1  34.03,61.64 0 top
R2  42.34,62.14 0 bottom
R3  15.17,62.02 180 top
R4  15.25,64.05 0 top
R5  87.2,67.24 270 top
R6  58.19,55.34 0 top
R7  33.71,32.43 90 top
R8  29.26,31.54 0 top
R9  46.79,34.75 90 bottom
R10  44.38,34.84 270 bottom
R11  47.04,25.44 90 bottom
R12  43.47,23.92 90 bottom
R13  43.49,26.71 90 bottom
R14  36.63,36.11 0 top
R15  65.02,75.9 270 top
R16  62.54,75.89 270 top
R17  60,75.99 270 top
R18  57.45,75.93 270 top
R19  22.03,76.19 90 top
R20  24.49,76.15 90 top
R21  27.05,76.1 90 top
R22  29.48,76.12 90 top
R23  58.22,50.33 0 top
R24  18.76,75.15 180 top
R25  18.75,73.3 180 top
R26  21.52,41.7 270 top
RFSWITCH  38.15,51.22 90 top
RFSWITCH2  40.57,9.95 270 top
SKR  73.89,73.1 0 top
U2  21.31,64.56 0 top
U3  37.64,67.35 270 top
U4  82.76,67.24 180 top
U5  55.55,18.08 0 top
U6  59.14,26.44 180 top
U7  37.64,30.14 270 top
U$2  8.43,46.27 270 top
XTAL1  29.39,60.49 90 top

### Tracks (layer width: path | path; a pad name or v marks a point on that pad's centre or on a via)
+3.3V  (via drill 0.25, 0.3)
  Top 0.254: U7.14 35.3,28.63 C20.1 33.83,29.51 33.58,29.76 v33.2,29.76 | L4.1 31.53,51.35 v29.9,51.35 | L6.1 v45.77,6.27 | XTAL1.4 25.12,61.7 C22.2 v25.07,62.78 | R6.1 v56.36,55.34 | v56.31,50.33 R23.1
  Top 0.508: JP1.9 11.36,73.19 11.79,72.77 11.92,72.77 v11.99,72.69
  Top 0.61: U2.3 v24.06,64.56 | v17.06,64.05 R4.2 | 85.68,66.49 C6.2 | 85.68,66.49 87.14,66.49 R5.2 v87.2,65.49 v87.21,65.49 | U4.1 85.58,66.59 85.68,66.49
  Bottom 0.508: v44.52,73.11 44.51,73.13 L3.1
  Bottom 0.61: v43.49,22.14 43.47,22.16 R12.1
  pour Route15: 1.59,91.13 34.69,91.13 34.94,91.38 36.4,89.92 36.4,89.16 55.02,89.16 56.84,90.98 89.36,90.98 89.69,90.65 89.69,56.43 88.53,55.27 88.53,37.21 90.39,35.36 90.39,4.23 88,1.84 56.37,1.84 54.61,3.6 37.1,3.6 35.34,1.84 2.08,1.84 1.82,2.09 1.82,34.98 3.34,36.49 3.34,54.63 1.52,56.45 1.52,86.86 1.38,87.01 1.38,90.95 1.56,91.13 1.56,91.13 1.56,91.13
+5V  (via drill 0.35)
  Top 0.203: 79.78,63.95 79.34,63.95 C5.2
  Top 0.61: 57.91,26.7 U6.3 | 52.5,27.22 52.64,27.36 | L(PA)3.2 36.09,26.08 35.64,25.63 v35.17,25.63 | C21.1 v50.74,27.36 v50.73,27.35
  Top 0.813: v82.48,58.53 82.48,62.31 80.84,63.95 79.34,63.95
  Bottom 0.61: v35.17,25.63 35.17,24.87 34.72,24.43 34.1,24.43 C37.1 | L(PA)2.2 44.11,37.36 C29.1 44.25,37.24 C30.1 45.91,37.25 | 47.44,30.65 C36.1 C41.1 45.51,30.78 L(PA)1.2 | 51.3,29.57 51.74,29.13 51.3,28.68 | 51.3,29.57 50.08,30.79 C34.1 | v50.73,27.35 50.73,28.11 51.3,28.68 | 51.3,29.57 51.3,28.68
  Bottom 0.813: C37.1 C35.1 | 51.74,29.13 66.35,29.13 | 82.41,58.53 v82.48,58.53
  Bottom 1.016: C35.1 29.78,24.44 29.14,23.79 29.14,10.2 34.6,4.74 70.92,4.74 85.02,18.84 85.02,42.67 83.2,44.49 | 66.35,29.13 81.71,44.49 | 81.71,44.49 82.45,45.23 | 83.2,44.49 82.45,45.23 | 81.71,44.49 83.2,44.49 | v82.48,58.53 82.45,58.51 82.45,45.23
  pour Top: 82.25,70.67 76.15,70.67 76.15,64.06 76.28,63.94 82.25,63.94
  pour Top (isolate 0.254): 52,26.46 58.35,26.46 58.35,28.11 52,28.11
  pour Bottom: 45.26,38.01 45.26,36.62 48.57,36.62 48.69,36.49 48.69,32.05 48.57,31.92 47.3,31.92 47.3,30.14 47.42,30.27 49.84,30.27 49.84,37 49.58,37.25 47.68,37.25 47.17,37.76 47.17,38.01
GND  (via drill 0.2, 0.2 layers 1-2, 0.25, 0.25 layers 1-2, 0.3, 0.3 layers 1-2, 0.35)
  Top 0.225: v40.57,11.98 40.57,11.6 | 38.03,65.83 37.64,66.21 U3.37 | FL1.6 48.63,39.98 v48.57,39.92 | v38.41,48.43 38.15,48.68 RFSWITCH.2
  Top 0.25: C28.2 v31.93,36.11 | C39.2 35.74,20.36 v35.61,20.24 | v35.61,39.03 35.61,39.93 | v40.06,61.26 39.27,61.26 C1.1 | C38.2 36.01,24.57 v35.61,24.17
  Top 0.254: U7.9 U7.10 U7.11 U7.12 | U7.13 U7.12 | 36.63,32.48 U7.6 36.64,31.43 v36.5,31.28 | 36.63,32.48 U7.7 | v36.5,34.08 36.5,33.32 36.63,33.19 36.63,32.48 | U7.21 39.75,27.8 39.98,28.03 U7.22 U7.23 38.89,29.14 v38.84,29.19 38.46,29.19 | C13.2 v47.42,6.27 | v19.23,60.49 19.09,60.63 C18.2 | v55.55,37.76 53,37.76 FL1.3 | v55.42,40.05 55.36,39.98 FL1.4 | 40.57,11.6 RFSWITCH2.2 | 35.61,39.93 C27.2 | FL1.1 50.29,37.89 v48.57,37.89 | C24.1 32.95,54.92 v32.95,56.18 32.95,56.3 | D2.C 14.46,73.3 v14.43,73.27 | C4.1 v32.69,59.99 | C22.1 v25.07,59.1 | D1.C 14.78,75.15 v14.74,75.11 | U7.12 36.11,29.64 v36.5,29.25 | U7.15 36.14,27.5 v35.49,26.84 | U7.2 38.64,31.43 v38.79,31.28 38.93,31.14 U7.27 | U7.4 v37.64,31.16 | U7.29 U7.25
  Top 0.305: U4.5 U4.7 U4.2
  Top 0.508: C6.1 v85.55,63.81 | R8.1 v26.98,31.54 | C31.2 v31.8,28.74 | C20.2 v33.83,25.82 | U$2.2 v8.43,42.33 | JP1.10 v7.93,74.72 | XTAL1.2 31.68,59.06 v31.68,58.21 | 55.55,16.04 v55.55,14.39 U5.2
  Top 0.61: SKR.1 v70.45,73.1 v70.45,73.11 | C17.2 v72.4,67.49 v72.38,67.51 | v79.33,61.14 C5.1 | U2.1 v19.3,65.51 | U6.4 57.53,23.74 v57.46,23.66
  Bottom 0.254: 40.08,74.83 C25.2 | 42.47,34.07 C32.2
  Bottom 0.508: v44.12,62.15 R2.1 | v34.09,21.76 C37.2 | C25.2 38.98,74.7 v38.96,74.72 | 42.47,34.07 44.33,34.07 R10.2 44.5,33.9 v44.5,32.81 | C29.2 44.25,38.79 C30.2 v45.9,40.3 | v45.52,28.24 C41.2 | v47.93,27.86 47.3,28.49 C36.2 C34.2 48.07,29.24
  Bottom 0.61: v45.39,21.89 C33.2 | v47.04,27.35 R11.2
  Bottom 0.813: C35.2 C37.2 34.09,21.89 | v40.65,76.44 40.67,76.46 C19.2
  other vias: 82.76,67.24 39.04,68.11 38.91,66.08 36.37,66.08 36.5,68.62 37.64,67.35 56.31,29.51 58.09,29.51 54.92,23.54 62.28,25.19 62.41,27.98 46.28,63.41 35.49,63.03 35.87,61.13 61.65,10.46 37.52,8.55 38.66,45.51 38.66,44.24 38.66,42.97 38.66,41.57 38.66,40.17 38.79,38.9 38.66,37.63 36.24,45.75 36.3,44.65 35.98,43.24 35.72,42.1 34.85,41.3 34.6,40.03 35.36,37.89 40.57,50.08 41.58,49.44 42.72,49.44 43.99,49.57 45.26,49.7 46.66,49.7 47.93,49.83 49.07,49.7 49.96,49.06 50.73,48.3 51.61,47.29 52.25,46.02 52.76,44.62 50.6,44.11 49.96,45.13 49.33,45.76 48.44,46.52 47.17,46.9 45.77,46.78 44.38,46.78 42.98,46.65 41.58,46.65 38.47,46.42 38.42,47.34 39.93,26.08 39.93,24.68 40.06,23.41 40.06,22.14 40.06,21 40.06,19.73 40.06,18.46 40.06,17.31 39.93,16.04 39.42,15.03 40.06,14.01 40.82,13.25 36.76,15.92 36.88,14.77 37.26,13.38 38.03,12.49 38.91,11.6 36.5,17.06 36.5,18.2 36.37,22.77 36.37,21.63 42.85,13.38 41.84,13.38 42.22,11.73 40.2,6.89 36.45,8.52 30.79,6.39 29.52,6.39 28.37,6.39 26.98,6.52 25.33,6.52 23.8,6.52 22.4,6.52 20.88,6.52 19.48,6.52 19.48,8.68 21.01,8.68 22.63,8.65 24.16,8.68 25.48,8.71 26.82,8.68 28.1,8.68 32.38,8.59 33.84,8.56 35.18,8.59 21.52,62.02 37.64,30.14 37.64,29.25 38.41,36.24 38.28,34.97 34.85,34.46 40.95,33.95 40.95,32.93 41.07,27.98 36.39,49.52 36.42,48.27 36.27,47 51.74,34.71 53.14,35.98 53.27,34.46 54.54,34.46 55.68,34.46 56.69,34.46 57.58,33.44 58.47,32.43 59.36,31.41 59.87,30.39 61.77,30.39 61.65,31.66 61.27,32.68 60.38,33.44 59.87,34.33 59.11,35.22 57.96,36.11 56.69,36.24 55.17,36.11 61.65,23.41 61.65,22.01 61.9,20.36 61.65,18.71 61.65,17.06 61.14,15.92 60,15.28 59.23,14.9 60,23.41 60,21.76 59.87,20.11 59.87,18.58 59.49,17.57 58.73,16.93 54.54,14.39 53.65,13.5 52.88,12.61 52,11.85 50.73,11.6 49.33,11.34 47.55,11.22 46.15,11.22 44.38,11.34 52.76,15.41 51.87,14.65 50.6,13.76 48.95,13.5 47.42,13.63 45.9,13.63 44.25,13.38 58.27,14.85 38.96,6.6 37.77,6.6 36.62,6.55 35.36,6.6 34.2,6.58 29.34,8.6 33.36,9.64 20.22,9.74 21.83,9.76 23.34,9.84 24.81,9.84 26.17,9.81 27.46,9.92 34.74,9.7 35.96,9.75 37.4,9.8 32.07,9.71 30.87,9.91 40.89,25.48 40.98,24.17 41.02,22.78 41.11,21.56 41.11,20.34 41.11,19.08 40.94,17.9 40.98,16.64 40.67,15.12 23.55,62.53 31.8,6.14
  pour Top: 58.73,24.17 58.73,28.87 53.27,28.87 53.27,30.14 59.49,30.14 59.49,22.9 53.52,22.9 53.52,24.17
  pour Top: 59.49,26.08 62.03,26.08 62.03,23.66 62.66,23.66 62.66,29.38 62.03,29.38 62.03,26.84 59.49,26.84
  pour Bottom (isolate 0.406): 40.57,70.02 40.57,64.56 34.72,64.56 34.85,64.68 34.85,70.02
  pour Route2: 3.03,90.04 35.53,90.04 35.56,90.07 36.76,88.86 54.98,88.86 56.55,90.43 90.97,90.43 91.08,90.54 91.08,87.12 91.26,86.94 91.26,55.71 90.97,55.42 89.79,55.42 88.42,54.05 88.42,36.79 91.22,33.98 91.22,2.36 89.48,0.62 58.44,0.62 56.08,2.99 36.21,2.99 34.02,0.79 2.68,0.79 2.68,0.79 2.68,34.81 3.46,35.59 3.46,54.55 3.83,54.92 3.83,55.56 3.73,55.67 1.35,55.67 1.11,55.91 1.11,86.68 1.08,86.71 1.08,89.86 1.08,89.86 1.08,89.87 1.08,89.87 1.08,89.87 1.08,89.87
N$1
  Top 0.25: C15.1 51.74,45 48.57,48.18 40.31,48.18 38.8,49.68 RFSWITCH.3
N$2
  Top 0.225: 36.73,59.18 C3.1
  Top 0.25: U3.23 37.64,62.02 36.6,60.98 L2.2
  Top 0.508: C3.1 36.63,59.96 L2.2
N$3
  Top 0.25: 36.65,58.08 C3.2 36.76,57.98 36.76,56.94 37.67,56.03 C2.1 38.15,58.34 38.15,59.22
  Top 0.61: 38.15,59.22 L1.2
N$4
  Top 0.25: 38.15,52.61 38.15,53.13 | 38.15,53.13 RFSWITCH.5 | 38.15,53.13 C2.2
N$5
  Top 0.25: C4.2 L2.1
N$6
  Top 0.25: 38.15,61.51 U3.24
  Top 0.508: L1.1 38.15,60.67 38.18,60.69
  Top 0.61: 38.18,60.69 C1.2 38.15,61.41 38.15,61.51
N$7
  Top 0.305: 36.65,70.78 U3.7 36.6,70.27 36.6,71.49 34.22,73.87 30.28,73.87 29.48,74.68 R22.1
N$8
  Top 0.254: R24.2 16.88,75.15 D1.A
N$9
  Top 0.305: R21.1 27.09,75.25 27.09,73.93 27.6,73.42 34.03,73.42 36.15,71.3 U3.8
N$10
  Top 0.305: U3.9 35.64,70.73 33.95,72.42 26.55,72.42 24.44,74.52 24.44,75.29 R20.1
N$11
  Top 0.305: U3.11 27.39,68.85 22.03,74.21 R19.1
N$12
  Top 0.305: U3.34 60.15,68.34 65.02,73.21 R15.2
N$13
  Top 0.305: U3.35 57.57,68.85 62.54,73.81 R16.2
N$14
  Top 0.254: U3.36 51.97,69.36
  Top 0.305: 51.97,69.36 55.46,69.36 60,73.91 R17.2
N$15
  Top 0.254: R18.2 57.45,74.16 54.74,71.45 49.4,71.45
  Top 0.305: R18.2 57.58,74.98 | 49.58,71.45 49.4,71.45 40.01,71.45 39.65,71.1 U3.1
N$16
  Top 0.254: U3.21 36.65,62.93 35.36,61.64 R1.2
N$17
  Top 0.254: XTAL1.3 33.15,61.7 R1.1
N$18
  Top 0.225: 33.96,51.1 33.83,51.1 33.33,51.1 L4.2
  Top 0.254: C24.2 33.07,51.36 L4.2 | RFSWITCH.6 37.5,53.27 36.88,53.89 35.61,53.89 34.85,53.13 34.85,51.73 34.22,51.1 33.83,51.1
N$19
  Top 0.61: C16.2 C26.1
N$20
  Top 0.25: RFSWITCH2.1 41.2,10.93 41.2,11.85 41.84,12.49 43.11,12.49 51.23,12.49 54.05,15.31 U5.1
N$21
  Top 0.25: C15.2 FL1.5
N$22
  Top 0.25: 60.92,25.01 U6.1 60.75,17.6 58.69,15.54 57.71,15.54
  Top 0.813: U5.3 57.05,15.56 57.08,15.54 57.71,15.54
N$23  (via drill 0.25)
  Top 0.254: v42.85,66.08 42.09,66.08 41.81,66.36 U3.30
  Bottom 0.254: C14.2 42.72,66.21 v42.85,66.08
N$27
  Top 0.254: R25.2 D2.A
N$28
  Top 0.225: 37.52,50.24 RFSWITCH.1
  Top 0.25: 37.52,49.06 37.52,49.32 | 37.52,49.32 37.52,50.24 | 37.52,49.32 C16.1
N$30
  Top 0.25: FL1.2 51.74,36.24 52.76,35.22 57.2,35.22 60.75,31.67 U6.2
N$31
  Top 0.61: U4.3 83.9,68.06 R5.1
N$32
  Top 0.254: U3.12
  Top 0.305: U3.12 27.03,68.34 20.22,75.15 R24.1
N$33
  Top 0.25: RFSWITCH2.5 40.57,8.3 39.62,7.35 J3.1
N$34
  Top 0.61: 38.29,18.98 C40.1
  Top 0.813: 38.29,18.98 C40.1 38.28,20.35 C39.1 38.29,21.61 L(PA)5.2
N$35
  Top 0.225: R14.2 37.4,36.06
  Top 0.25: U7.3 38.15,33.82 37.44,34.53 | R14.2 37.44,34.53 | U7.5 37.14,34.23 37.44,34.53
  Top 0.61: 37.44,36.03 R14.2 37.44,37.3 L(PA)4.2
N$36  (via drill 0.35)
  other vias: 51.11,35.73
N$37
  Top 0.225: L(PA)4.1
  Top 1.016: C26.2 37.52,40.31 C27.1 L(PA)4.1
N$38  (via drill 0.35)
  Top 0.254: 39.14,34.44 39.14,33.06 U7.1
  Top 0.508: v40.06,37.51 39.14,36.59 39.14,33.06
  Bottom 0.61: v40.06,37.51 41.06,37.51 L(PA)2.1
N$39  (via drill 0.25)
  Top 0.254: 39.99,30.65 U7.26
  Top 0.406: U7.26 41.57,30.64
  Top 0.508: 41.57,30.64 v41.71,30.78
  Bottom 0.508: L(PA)1.1 v41.71,30.78
N$40
  Top 0.813: 38.14,26.11 L(PA)3.1 38.29,25.96 C38.1 38.29,23.19 L(PA)5.1
  pour Top: 38.79,28.11 38.79,25.57 37.77,25.57 37.77,26.46 36.88,27.35 36.49,27.35 36.49,28.11
N$41
  Bottom 0.508: 45.52,24.69 C33.1
  Bottom 0.61: R11.1 45.46,24.63 C33.1 43.51,24.69 R12.2
  Bottom 0.813: R13.1 43.47,25.88 R12.2 43.43,24.69 | 47.11,24.69 R11.1
N$42
  Top 0.254: C13.1 L6.2 45.65,9.57 44.38,9.57 43.61,8.81 43.61,7.92 43.11,7.41 41.71,7.41 41.22,7.9 RFSWITCH2.6
N$43
  Top 0.25: C28.1 R14.1
N$44
  Top 0.254: 27.99,67.86 28.11,67.86 | R25.1 19.66,73.2
  Top 0.305: U3.13 28.11,67.86 25.93,67.86 20.59,73.2 19.66,73.2
N$45  (via drill 0.25)
  Top 0.254: v48.06,33.95 43.74,33.95 v41.96,32.17 | v35.36,33.32 35.28,33.24 R7.2
  Top 0.508: U$2.1 10.59,47.54 R26.2 18.98,36.62 22.35,33.24 R7.2
  Bottom 0.254: v41.96,32.17 36.5,32.17 v35.36,33.32
  Bottom 0.508: R9.1 46.8,33.95 v48.06,33.95
N$55
  Top 0.25: RFSWITCH2.3 39.92,12.49 39.92,12.5 38.28,14.14 38.28,17.06
  Top 0.813: 38.28,17.06 C40.2
N$57  (via drill 0.25)
  Top 0.225: U3.25 U3.26
  Top 0.254: 40.51,65.83 U3.28 | 40.51,65.83 U3.29 | U3.10 34.75,69.36 34.72,69.38 32.65,69.38 v32.55,69.48 | v38.91,62.93 39.14,63.16 U3.26 | U3.22 37.09,64.43 37.09,62.39 v36.6,61.9 | v32.95,65.07 34.09,63.92 35.49,63.92 35.64,64.08 U3.19 | v38.41,72.24 38.41,71.54 39.14,70.81 U3.2 | v42.19,64.94 42.09,64.94 41.2,65.83 40.51,65.83
  Bottom 0.254: C9.1 v32.95,65.07 | 37.01,62.91 C10.1 | 42.19,64.79 v42.19,64.94 | v42.19,64.94 42.19,64.92 | v42.19,64.94 42.19,64.56 | 42.19,64.56 42.19,63.77 41.35,62.93 39.14,62.93 | 38.91,63.16 C12.1 | 39.14,62.93 38.91,63.16 | 38.91,63.16 v38.91,62.93 39.14,62.93 | C7.1 38.41,71.67 38.41,72.18 | v42.19,64.94 41.84,64.94 | 42.19,64.56 41.84,64.92
  Bottom 0.406: C11.1 v42.19,64.94
  Bottom 0.508: 38.41,72.18 38.41,71.85 | v32.95,65.07 32.95,64.18 35.22,61.9 v36.6,61.9 36.6,61.99 37.01,62.4 37.01,62.91 | v38.41,72.24 38.03,72.24 | 38.03,72.24 34.78,72.24 33.58,71.04 33.58,69.37 | 38.03,72.24 38.41,71.85 | 38.41,71.85 38.41,71.67
  Bottom 0.61: v32.95,65.07 32.95,67.73 33.58,68.37 33.58,69.37 C8.1 32.65,69.38 v32.55,69.48 | v42.19,64.94 43.31,64.94 43.87,65.5 43.87,70.02 41.21,72.69 | 41.21,72.69 40.77,73.12 | 41.21,72.69 41.21,73.56
  Bottom 0.813: C25.1 41.53,74.73 41.58,74.68 | 41.58,74.68 L3.2 43.43,76.42 C19.1 | v38.41,72.24 39.29,73.12 40.77,73.12 41.21,73.56 41.58,73.93 41.58,74.68
N$62  (via drill 0.25)
  Top 0.254: U3.27 39.65,63.69 40.26,63.09 v40.26,62.27
  Bottom 0.254: v40.26,62.27 41.4,62.27 R2.2
POW
  Top 0.508: 78.91,76.03 78.91,75.61
  Top 0.813: 75.99,73.21 SKR.2
  Top 1.016: 75.99,73.21 L5.1 78.91,75.61 | J1.48 J1.50 78.91,76.03
PROG_DC
  Top 0.254: U3.16 34.75,66.34 | 24.18,66.34 19.93,70.59
  Top 0.305: 34.75,66.34 24.18,66.34 | 19.93,70.59 11.91,70.59 10.91,69.59 10.02,69.59 10.02,69.6 8.83,69.6 7.93,70.5 JP1.8
PROG_DD
  Top 0.305: U3.15 25.2,66.84 20.25,71.8 11.61,71.8 JP1.7
RST  (via drill 0.35)
  Top 0.254: R3.1 17.66,62.02 C18.1 17.83,63.41 18.03,63.61 U2.2 22.85,63.61 v22.91,63.54 | v47.3,63.67 44.12,66.84 U3.31 | 4.79,75.49 6.7,77.41 17.57,77.41 19.33,79.17 J1.06
  Top 0.305: v21.74,58.17 8.58,58.17 4.79,61.96 4.79,75.49
  Bottom 0.254: 27.87,54.4 38.03,54.4 43.11,59.48 45.65,59.48 47.3,61.13 v47.3,63.67
  Bottom 0.305: 22.91,59.35 23.29,58.98 | 23.29,58.98 27.87,54.4 | v22.91,63.54 22.91,59.35 | 22.6,59.03 22.91,59.34 22.91,59.35 | 22.6,59.03 v21.74,58.17 | 23.29,58.98 22.65,58.98 22.6,59.03
RSTCC
  Top 0.254: 14.35,62.27 R3.2 13.51,62.02 11.23,64.3 | R4.1 14.44,62.36 14.35,62.27 | 14.35,62.27 14.1,62.02 | JP1.4 8.05,65.57 8.05,65.45
  Top 0.305: JP1.4 9.2,64.3 11.23,64.3
RXMODEC  (via drill 0.35)
  Top 0.254: RFSWITCH.4 38.8,53.91 v39.55,54.65 47.17,54.65 51.74,59.22 | U3.32 45.88,67.35 48.57,64.66 48.57,62.91 51.74,59.73 | 52,59.48 56.69,59.48 59,57.17 R6.2 59.08,55.41 JP2.1
  Top 0.305: 52,59.48 51.74,59.73 51.74,59.22 52,59.48
  Bottom 0.254: 39.55,54.78 v39.55,54.65
RXMODEC2  (via drill 0.25)
  Top 0.254: v38.53,8.68 38.84,8.98 RFSWITCH2.4 | JP2.3 R23.2 | 62.28,50.72 62.79,51.22 66.09,54.53 66.09,65.07 63.3,67.86 U3.33
  Top 0.305: v62.28,9.57 72.32,19.6 72.32,39.92 62.22,50.02 | 62.22,50.02 JP2.3 62.28,50.72 | 62.79,51.22 62.22,50.65 62.22,50.02
  Bottom 0.305: v62.28,9.57 61.39,8.68 v38.53,8.68
UART0_CTS
  Top 0.254: 57.5,76.8 R18.1 57.43,76.76 J1.36
UART0_RTS
  Top 0.254: R17.1 60.04,76.85 59.97,76.92 J1.38
UART0_RX
  Top 0.254: 62.58,76.75 62.57,76.74 | 62.57,76.74 R16.1 | J1.40 62.51,76.8 62.57,76.74
UART0_TX
  Top 0.254: R15.1 65.12,76.82 65.05,76.89 J1.42
UART1_CTS
  Top 0.254: J1.14 29.49,76.95 R22.2
  Top 0.305: 29.56,77.02 R22.2
UART1_RTS
  Top 0.254: J1.12 26.95,77.02 27.02,76.95
  Top 0.305: R21.2 27.02,76.95
UART1_RX
  Top 0.254: J1.08 21.87,77.17 21.94,77.1
  Top 0.305: R19.2 21.94,77.1
UART1_TX
  Top 0.254: J1.10 24.41,77.04 R20.2
  Top 0.305: R20.2
VGS1
  Top 0.254: U7.8 33.74,31.64 R7.1 31.86,31.61 C31.1 30.09,31.55 R8.2
VGS2  (via drill 0.25)
  Top 0.254: 39.99,31.65 U7.28 40.17,31.64
  Top 0.406: U7.28 39.98,32.6
  Top 0.508: 39.98,32.6 39.98,34.38 v41.2,35.6
  Bottom 0.508: v41.2,35.6 41.21,35.61 C32.1 42.26,35.66 R10.1 46.7,35.66 R9.2
VGS3  (via drill 0.25)
  Top 0.254: U7.24 40.57,29.64
  Top 0.508: 40.57,29.64 40.57,29.63 41.84,29.63 42.34,29.13 v42.34,27.6
  Bottom 0.508: v42.34,27.6 42.42,27.53 R13.2

### Text on the board
NamesTop: TAMILARUVI / RF TRANSCIEVER / AUG 24